# Altium schematic sheet BackPage.SchDoc: BackPage
size Letter; Engineer: Will Knutson; Revision: A; SheetNumber: 2; SheetTotal: 2; ProjectGroup: Severson Group; ProjectOrganization: WEMPEC; ProjectUniversity: UW-Madison; ProjectRev: A
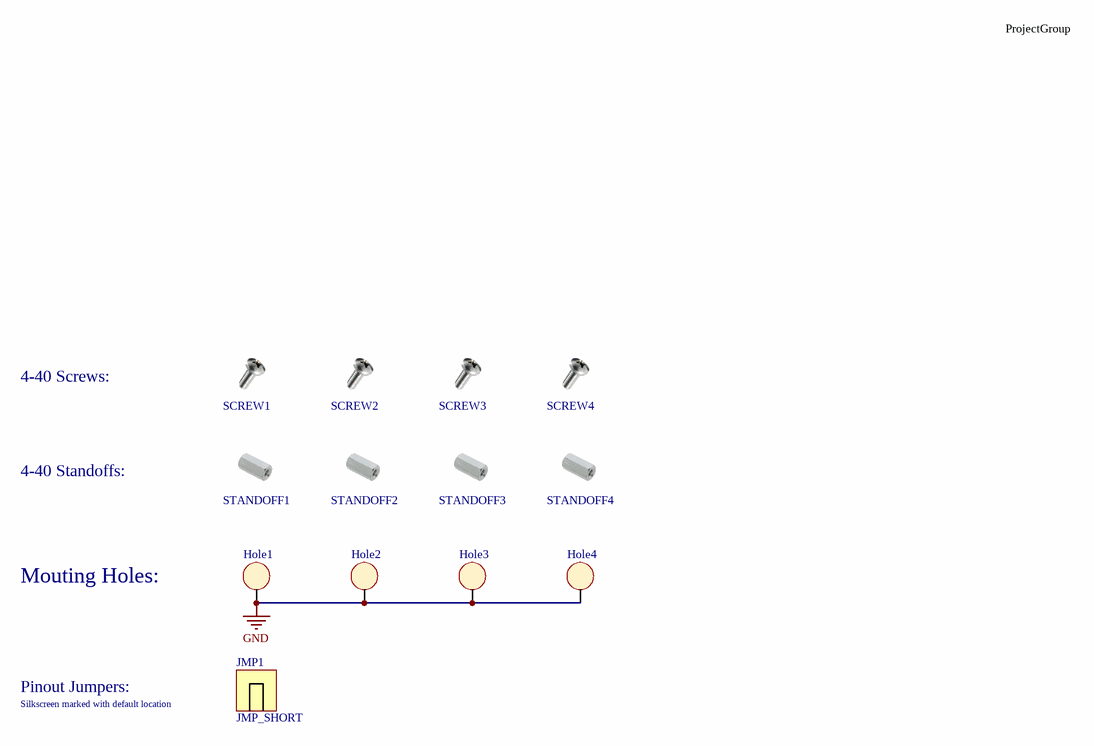
[diagram p0: BackPage.SchDoc]

## Parts
Hole1  MOUNT_HOLE  [MOUNTING_HOLE]  (value not drawn)  (no BOM)
Hole2  MOUNT_HOLE  [MOUNTING_HOLE]  (value not drawn)  (no BOM)
Hole3  MOUNT_HOLE  [MOUNTING_HOLE]  (value not drawn)  (no BOM)
Hole4  MOUNT_HOLE  [MOUNTING_HOLE]  (value not drawn)  (no BOM)
JMP1  JMP_SHORT  (mechanical)
SCREW1  9900  (value not drawn)  (mechanical)
SCREW2  9900  (value not drawn)  (mechanical)
SCREW3  9900  (value not drawn)  (mechanical)
SCREW4  9900  (value not drawn)  (mechanical)
STANDOFF1  2057-440-AL-7  (value not drawn)  (mechanical)
STANDOFF2  2057-440-AL-7  (value not drawn)  (mechanical)
STANDOFF3  2057-440-AL-7  (value not drawn)  (mechanical)
STANDOFF4  2057-440-AL-7  (value not drawn)  (mechanical)

## Nets
GND: Hole1.1 Hole2.1 Hole3.1 Hole4.1

## Notes on the sheet
- ProjectGroup
- 4-40 Screws:
- 4-40 Standoffs:
- Mouting Holes:
- Pinout Jumpers:
- (near JMP1) Silkscreen marked with default location
- Title:
- File:
- Sheet:
- of
- Revision:
- Time:
- Date:
- Engineer:

## Library data of the parts
Hole1-Hole4 = MOUNT_HOLE: MOUNTING HOLE
JMP1 = JUMPER_SHORT: CONN JUMPER SHORTING .100" GOLD; Supplier 1: Digi-Key; Supplier Part Number 1: S9337-ND
SCREW1-SCREW4 = SCREW 4-40: #4-40 Pan Head Machine Screw Phillips Drive Stainless Steel; Supplier 1: Digi-Key; Supplier Part Number 1: 36-9900-ND
STANDOFF1-STANDOFF4 = Standoff 4-40: Hex Standoff Threaded #4-40 Aluminum 0.500" (12.70mm) 1/2"; Supplier 1: Digi-Key; Supplier Part Number 1: 1772-1993-ND